# EAGLE schematic Tag Reader r1 (EAGLE 7.7.0)
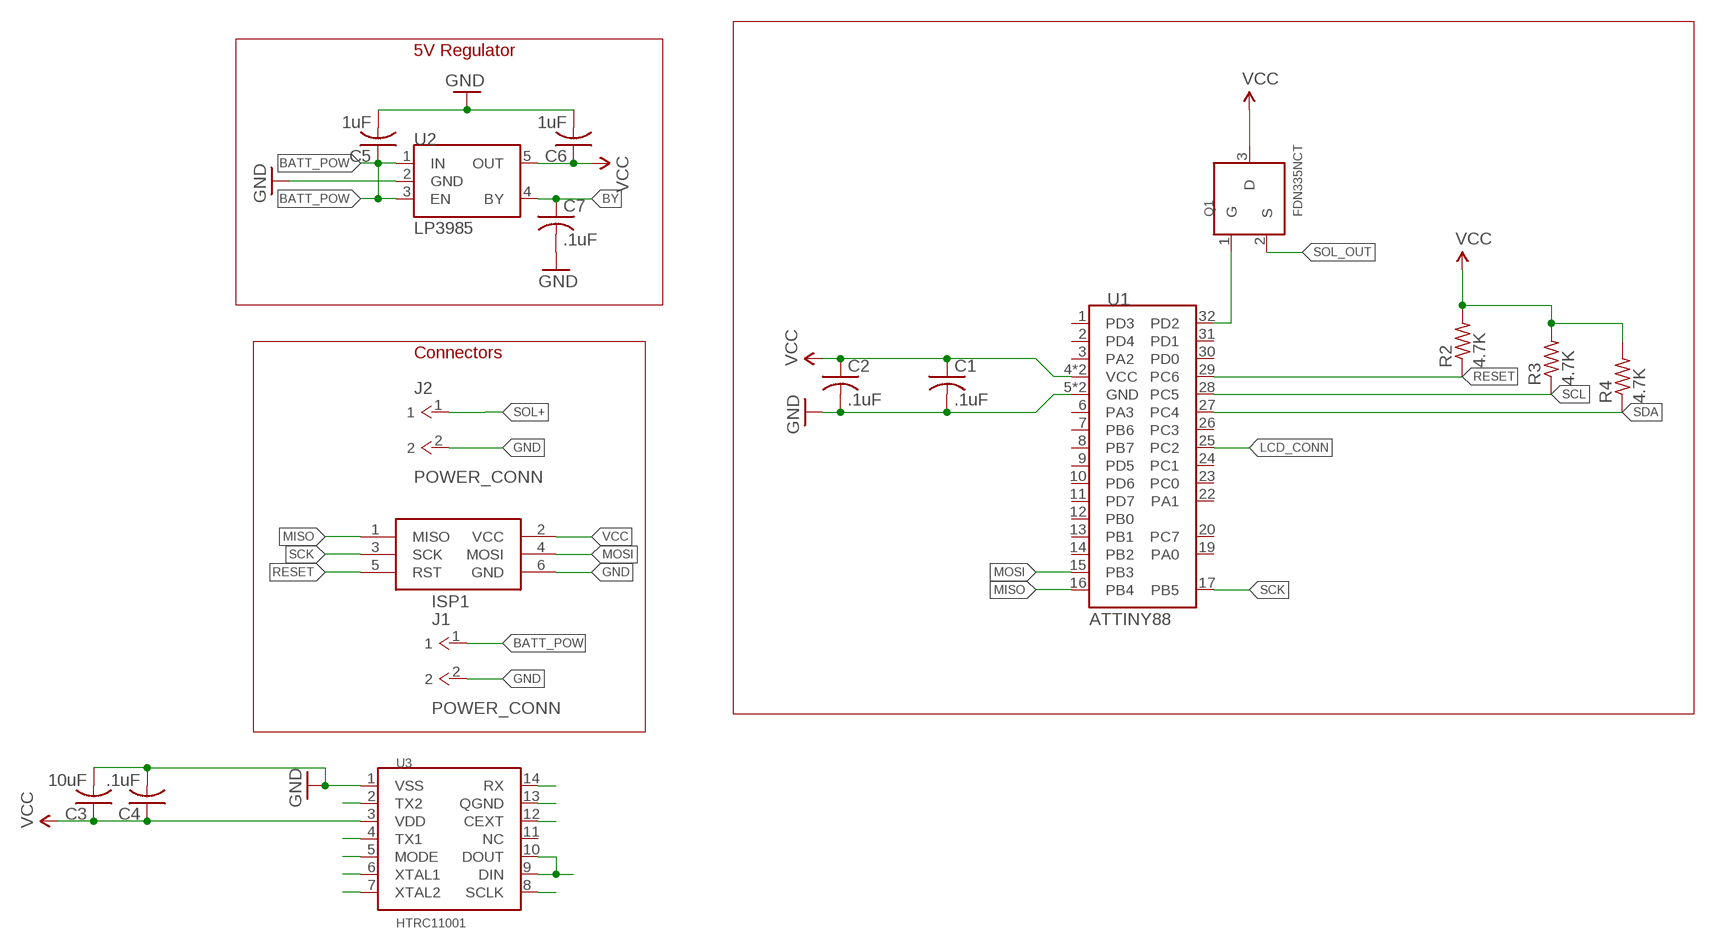
[diagram p0: schematic, sheet 1]

## Parts
C1  .1uF  C-USC0603  [C0603]
C2  .1uF  C-USC0603  [C0603]
C3  10uF  C-USC0603  [C0603]
C4  .1uF  C-USC0603  [C0603]
C5  1uF  C-USC0603  [C0603]
C6  1uF  C-USC0603  [C0603]
C7  .1uF  C-USC0603  [C0603]
ISP1  AVRISP-6  [AVRISP]
J1  POWER_CONN  [640455_CONN]
J2  POWER_CONN  [640455_CONN]
Q1  FDN335NCT  [SOT23-3]
R2  4.7K  R-US_R0603  [R0603]
R3  4.7K  R-US_R0603  [R0603]
R4  4.7K  R-US_R0603  [R0603]
U1  ATTINY88  [32-TQFP]
U2  LP3985  [SOT23-5]
U3  HTRC11001  [14-SOIC]

## Nets
BATT_POW: C5.1 J1.1 U2.1(IN) U2.3(EN)
BY: C7.1 U2.4(BY)
GND: C1.2 C2.2 C3.2 C4.2 C5.2 C6.2 C7.2 ISP1.6(GND) J1.2 J2.2 U1.5(GND) U1.21(GND) U2.2(GND) U3.1(VSS)
LCD_CONN: U1.25(PC2)
MISO: ISP1.1(MISO) U1.16(PB4)
MOSI: ISP1.4(MOSI) U1.15(PB3)
N$2: U3.2(TX2)
N$4: U3.4(TX1)
N$5: U3.5(MODE)
N$6: U3.6(XTAL1)
N$7: U3.7(XTAL2)
N$8: U3.8(SCLK)
N$10: U3.9(DIN) U3.10(DOUT)
N$11: U3.12(CEXT)
N$12: U3.13(QGND)
N$13: U3.14(RX)
RESET: ISP1.5(RST) R2.1 U1.29(PC6)
SCK: ISP1.3(SCK) U1.17(PB5)
SCL: R3.1 U1.28(PC5)
SDA: R4.1 U1.27(PC4)
SOL+: J2.1
SOL_EN: Q1.1(G) U1.32(PD2)
SOL_OUT: Q1.2(S)
VCC: C1.1 C2.1 C3.1 C4.1 C6.1 ISP1.2(VCC) Q1.3(D) R2.2 R3.2 R4.2 U1.4(VCC) U1.18(VCC) U2.5(OUT) U3.3(VDD)
Unconnected: U1.1(PD3) U1.2(PD4) U1.3(PA2) U1.6(PA3) U1.7(PB6) U1.8(PB7) U1.9(PD5) U1.10(PD6) U1.11(PD7) U1.12(PB0) U1.13(PB1) U1.14(PB2) U1.19(PA0) U1.20(PC7) U1.22(PA1) U1.23(PC0) U1.24(PC1) U1.26(PC3) U1.30(PD0) U1.31(PD1) U3.11(NC)

## Notes on the sheet
- 5V Regulator
- Connectors

## Library data of the parts
C1-C7 = resistor:C-US: CAPACITOR, American symbol
ISP1 = adafruit:AVRISP: AVR ISP HEADER Standard 6 pin header for AVR programming
J1 J2 = Tag Reader:POWER_CONN
Q1 = Tag Reader:FDN335NCT
R2-R4 = rcl:R-US_: RESISTOR, American symbol
U1 = Tag Reader:ATTINY88
U2 = Tag Reader:LP3985
U3 = Tag Reader:HTRC11001